# EAGLE schematic MultiBoard (EAGLE 9.2.2)
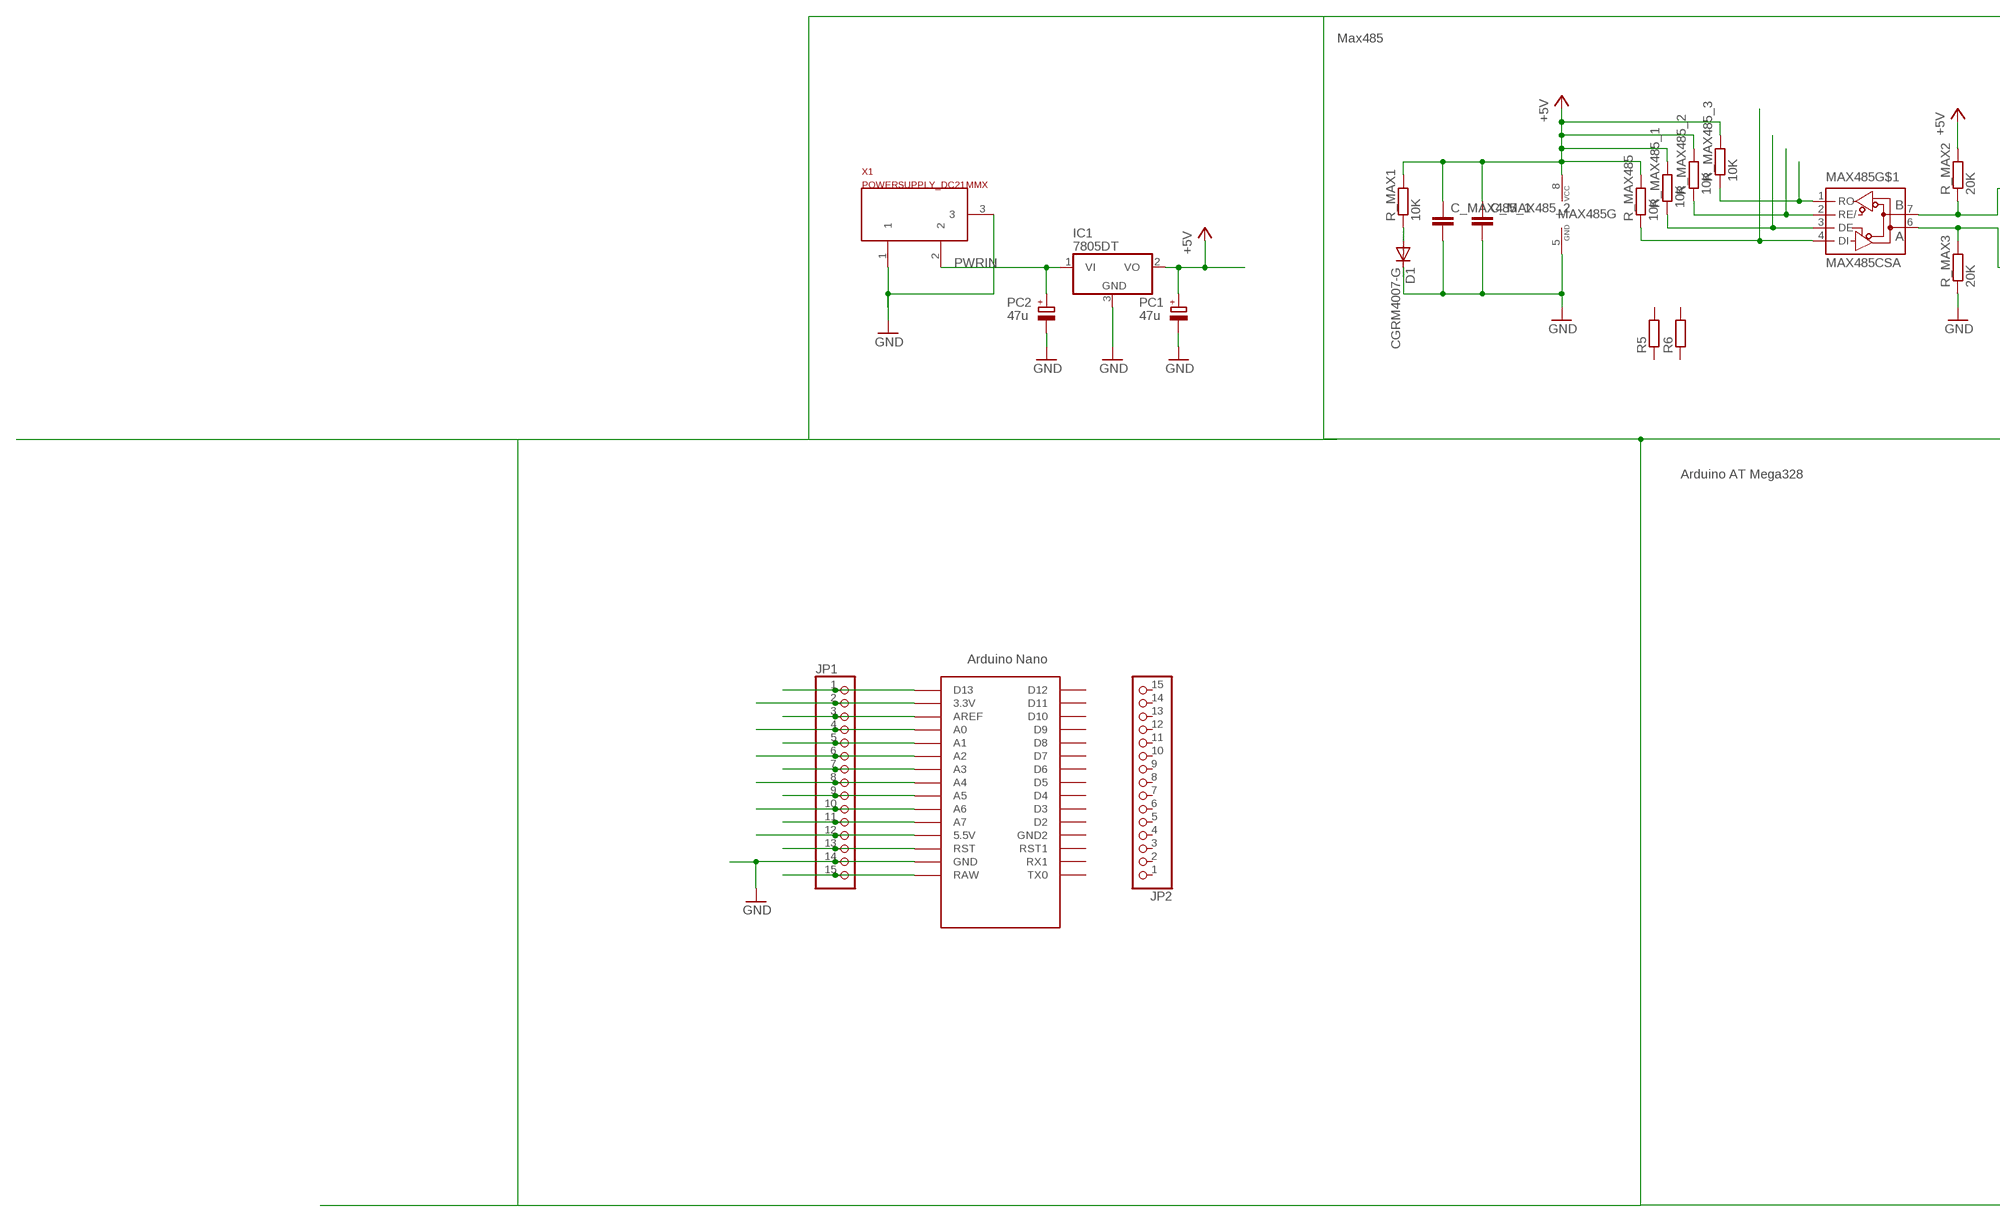
[diagram p0: schematic, sheet 1, part 1 of 2]
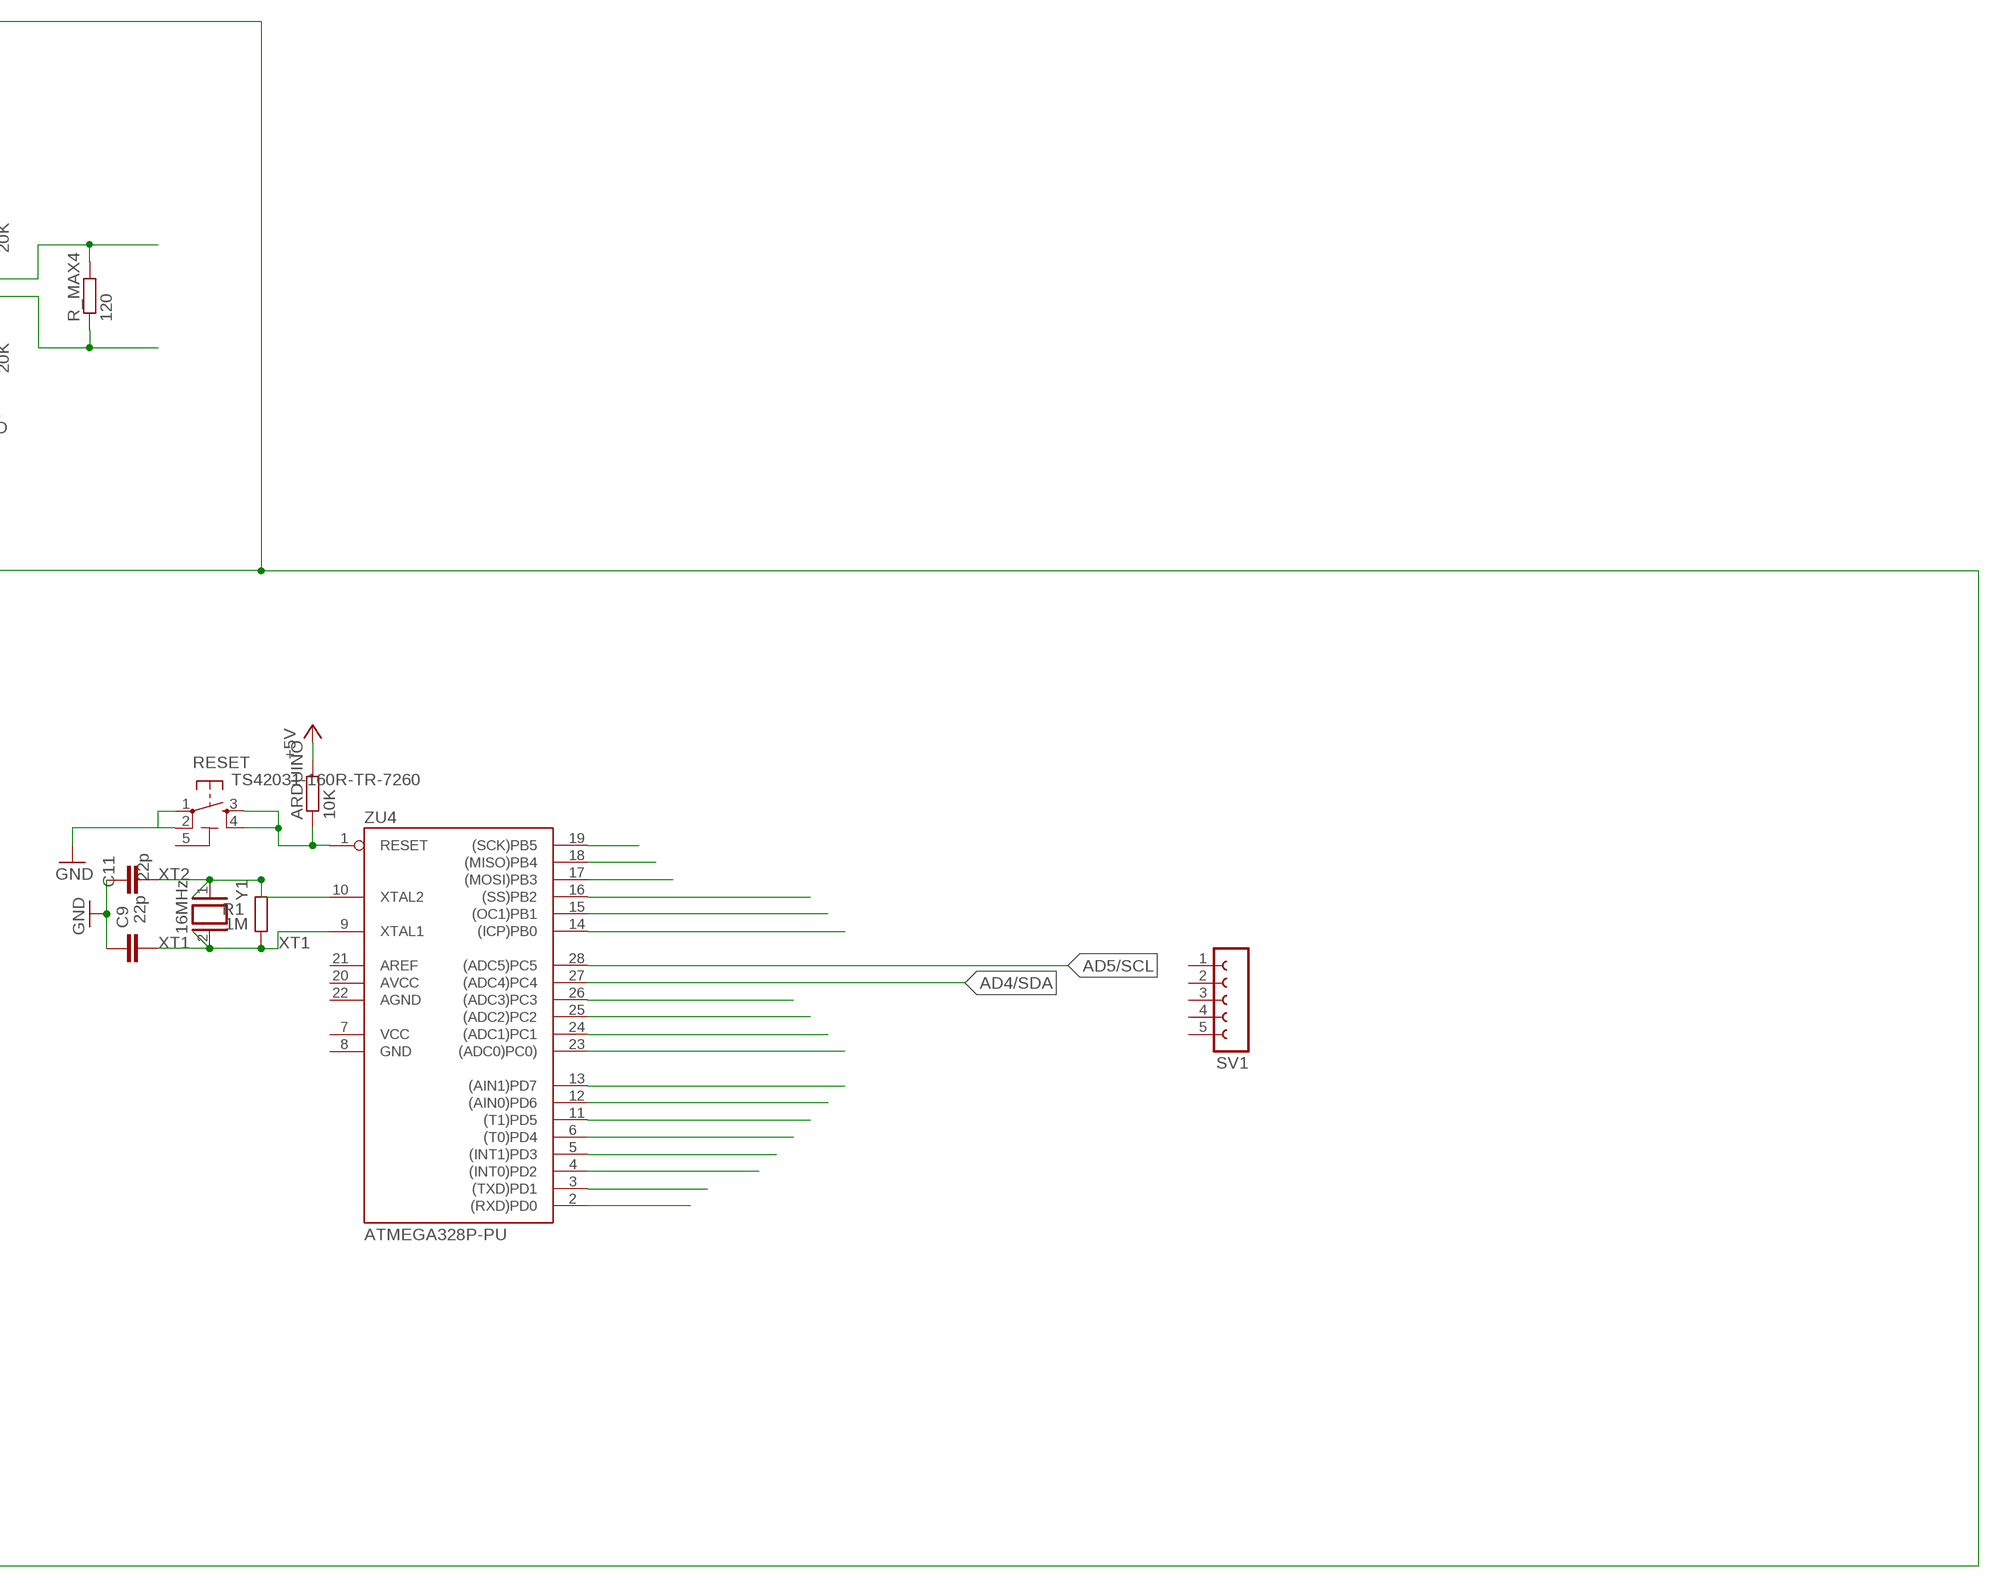
[diagram p1: schematic, sheet 1, part 2 of 2]

## Parts
ARDUINO  10K  R-EU_R0402  [R0402]
C9  22p  C-EU0603-RND  [C0603-ROUND]
C11  22p  C-EU0603-RND  [C0603-ROUND]
C_MAX485_1  C-EUC0402  [C0402]
C_MAX485_2  C-EUC0402  [C0402]
D1  CGRM4007-G  [SOD-123_MINI-SMA]
IC1  7805DT  [TO252]
JP1  PINHD-1X15  [1X15]
JP2  PINHD-1X15  [1X15]
MAX485  MAX485CSA  [SO08]
PC1  47u  CPOL-EUD  [PANASONIC_D]
PC2  47u  CPOL-EUD  [PANASONIC_D]
R1  1M  R-EU_R0603  [R0603-ROUND]
R5  R-EU_M0805  [M0805]
R6  R-EU_M0805  [M0805]
R_MAX1  10K  R-EU_R0402  [R0402]
R_MAX2  20K  R-EU_R0402  [R0402]
R_MAX3  20K  R-EU_R0402  [R0402]
R_MAX4  120  R-EU_R0402  [R0402]
R_MAX485  10K  R-EU_R0402  [R0402]
R_MAX485_1  10K  R-EU_R0402  [R0402]
R_MAX485_2  10K  R-EU_R0402  [R0402]
R_MAX485_3  10K  R-EU_R0402  [R0402]
RESET  TS42031-160R-TR-7260  TS42  [TS42]
SV1  FE05-1  [FE05-1]
U$1  NANO  [NANO]
X1  POWERSUPPLY_DC21MMX  [POWERSUPPLY_DC-21MM]
Y1  16MHz  XTAL/S  [QS]
ZU4  ATMEGA328P-PU  [DIL28-3]

## Nets
+5V: ARDUINO.2 C_MAX485_1.1 C_MAX485_2.1 IC1.2(VO) MAX485.8(G:VCC) PC1.+ R_MAX1.2 R_MAX2.2 R_MAX485.2 R_MAX485_1.2 R_MAX485_2.2 R_MAX485_3.2
AD0: ZU4.23((ADC0)PC0))
AD1: ZU4.24((ADC1)PC1)
AD2: ZU4.25((ADC2)PC2)
AD3: ZU4.26((ADC3)PC3)
AD4/SDA: ZU4.27((ADC4)PC4)
AD5/SCL: ZU4.28((ADC5)PC5)
GND: C9.2 C11.2 C_MAX485_1.2 C_MAX485_2.2 D1.C IC1.3(GND) JP1.14 MAX485.5(G:GND) PC1.- PC2.- R_MAX3.1 RESET.1 RESET.2 U$1.GND X1.1 X1.3
IO0: ZU4.2((RXD)PD0)
IO1: ZU4.3((TXD)PD1)
IO2: ZU4.4((INT0)PD2)
IO3: ZU4.5((INT1)PD3)
IO4: ZU4.6((T0)PD4)
IO5: ZU4.11((T1)PD5)
IO6: ZU4.12((AIN0)PD6)
IO7: ZU4.13((AIN1)PD7)
IO8: ZU4.14((ICP)PB0)
IO9: ZU4.15((OC1)PB1)
MISO: ZU4.18((MISO)PB4)
MOSI: ZU4.17((MOSI)PB3)
N$1: MAX485.1(RO) R_MAX485_3.1
N$2: MAX485.2(RE/) R_MAX485_2.1
N$3: MAX485.3(DE) R_MAX485_1.1
N$4: MAX485.4(DI) R_MAX485.1
N$5: MAX485.7(B) R_MAX2.1 R_MAX4.2
N$6: D1.A R_MAX1.1
N$7: MAX485.6(A) R_MAX3.2 R_MAX4.1
N$9: JP1.1 U$1.D13
N$10: ARDUINO.1 RESET.3 RESET.4 ZU4.1(RESET)
N$11: JP1.2 U$1.3.3V
N$12: JP1.3 U$1.AREF
N$13: JP1.4 U$1.A0
N$14: JP1.5 U$1.A1
N$15: JP1.6 U$1.A2
N$16: JP1.7 U$1.A3
N$17: JP1.8 U$1.A4
N$18: JP1.9 U$1.A5
N$19: JP1.10 U$1.A6
N$20: JP1.11 U$1.A7
N$21: JP1.12 U$1.5V(5.5V)
N$22: JP1.13 U$1.RST
N$24: JP1.15 U$1.RAW
PWRIN [power]: IC1.1(VI) PC2.+ X1.2
SCK: ZU4.19((SCK)PB5)
SS: ZU4.16((SS)PB2)
XT1: C9.1 R1.1 Y1.2 ZU4.9(XTAL1)
XT2: C11.1 R1.2 Y1.1 ZU4.10(XTAL2)
Unconnected: JP2.1 JP2.2 JP2.3 JP2.4 JP2.5 JP2.6 JP2.7 JP2.8 JP2.9 JP2.10 JP2.11 JP2.12 JP2.13 JP2.14 JP2.15 R5.1 R5.2 R6.1 R6.2 SV1.1 SV1.2 SV1.3 SV1.4 SV1.5 U$1.D2 U$1.D3 U$1.D4 U$1.D5 U$1.D6 U$1.D7 U$1.D8 U$1.D9 U$1.D10 U$1.D11 U$1.D12 U$1.GND1(GND2) U$1.ICSP1 U$1.ICSP2 U$1.ICSP3 U$1.ICSP4 U$1.ICSP5 U$1.ICSP6 U$1.RST1 U$1.RX1 U$1.TX0 ZU4.21(AREF)

## Notes on the sheet
- Max485
- Arduino AT Mega328

## Power pins joined to a net without a drawn wire
5-GND: RESET.5(5-GND)
AGND: ZU4.22(AGND)
AVCC: ZU4.20(AVCC)
GND: ZU4.8(GND)
VCC: ZU4.7(VCC)

## Library data of the parts
ARDUINO R5 R6 R_MAX1-R_MAX4 R_MAX485 R_MAX485_1-R_MAX485_3 = rcl:R-EU_: RESISTOR, European symbol; SPICEPREFIX: R
C9 C11 = SmartPrj:C-EU: CAPACITOR, European symbol
C_MAX485_1 C_MAX485_2 = rcl:C-EU: CAPACITOR, European symbol; SPICEPREFIX: C
D1 = diode:CGRM400*-G: Molded plasitc,JEDEC SOD-123/Mini SMA Source: Comchip CGRM4001-G.pdf
IC1 = linear:78*: Positive VOLTAGE REGULATOR Source: http://cache.national.com/ds/LM/LM78L05.pdf http://www.fairchildsemi.com/ds/LM/LM7805.pdf
JP1 JP2 = pinhead:PINHD-1X15: PIN HEADER
MAX485 = andereBauteile:MAX485: MAX485 RS485 Half Duplex Driver
PC1 PC2 = rcl:CPOL-EU: POLARIZED CAPACITOR, European symbol
R1 = SmartPrj:R-EU_: RESISTOR, European symbol
RESET = SmartPrj:TS42: TS42 Dongnan Electronics Tact switch VDC 12V - 50mA
SV1 = con-lsta:FE05-1: FEMALE HEADER; OC_FARNELL: unknown; OC_NEWARK: unknown
U$1 = Arduino-clone:NANO: Arduino Nano
X1 = SmartPrj:POWERSUPPLY_DC21MM
Y1 = SmartPrj:XTAL/S: CRYSTAL
ZU4 = SmartPrj:ATMEGA328P-: MICROCONTROLLER 4 Kbytes FLASH 128 bytes SRAM 256 bytes EEPROM UART 6-channel 10 bit ADC

## Net classes
0 default: width 0.254 mm, clearance 0.254 mm
1 power: width 0.61 mm, drill 0.61 mm, clearance 0.254 mm
2 gnd: width 0.305 mm, drill 0.559 mm, clearance 0.254 mm
3 usbvcc: width 0.508 mm, drill 0.61 mm, clearance 0.254 mm
4 aref: width 0.406 mm, drill 0.61 mm, clearance 0.254 mm